# Altium schematic sheet Housekeeping.SchDoc
size B; SheetNumber: 2; SheetTotal: 5
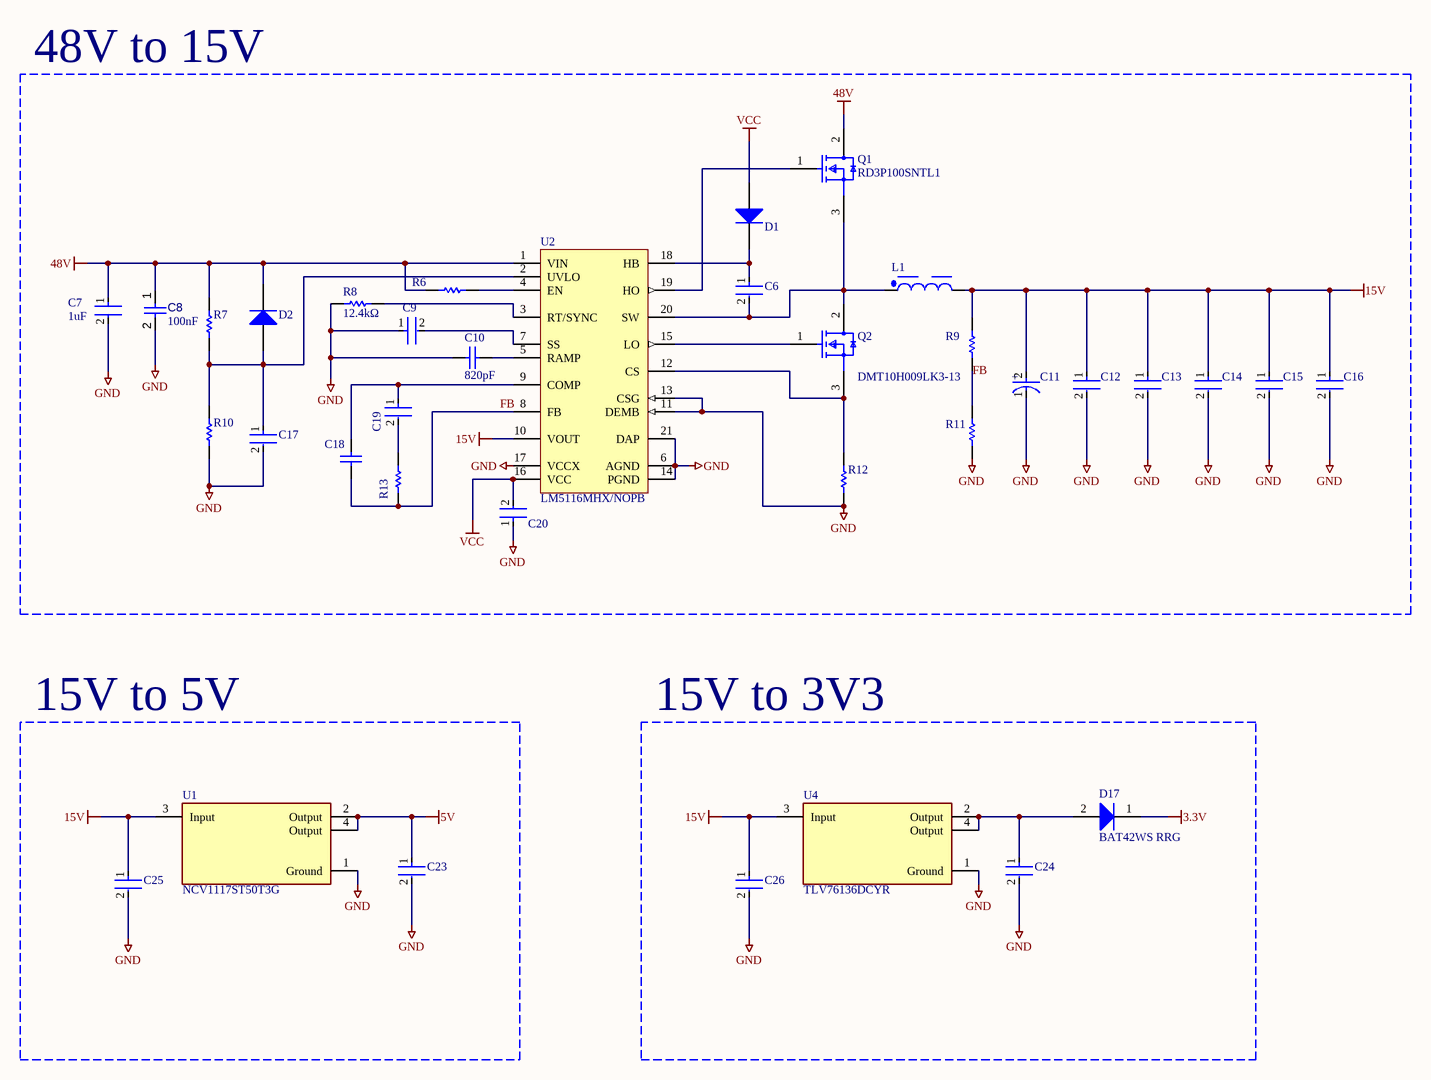
[diagram p0: Housekeeping.SchDoc]

## Parts
C6  UMK107AB7105KA-T  [FP-0603-L_1_6_0_15-W_0_8-IPC_C]  (value not drawn)
C7  Capacitance: 1uF  [FP-C1210C105K1RACTU-MFG]  (hidden comment: C1210C105K1RACTU)
C8  value 100nF  [FP-CL10-IPC_B]  (hidden comment: CL10B104KC8NNNC)
C9  CL10B104KC8NNNC  [FP-CL10-IPC_A]  (value not drawn)
C10  value 820pF  [0603N821J500CT-Footprint-1]  (hidden comment: 0603N821J500CT)
C11  50SVPF10M  [FP-OS-CON-SMT-C6-MFG]  (value not drawn)
C12  CL31A106KBHNNNE  [FP-CL31-IPC_C]  (value not drawn)
C13  CL31A106KBHNNNE  [FP-CL31-IPC_C]  (value not drawn)
C14  CL31A106KBHNNNE  [FP-CL31-IPC_C]  (value not drawn)
C15  CL31A106KBHNNNE  [FP-CL31-IPC_C]  (value not drawn)
C16  CL31A106KBHNNNE  [FP-CL31-IPC_C]  (value not drawn)
C17  UMK107AB7105KA-T  [FP-0603-L_1_6_0_15-W_0_8-IPC_C]  (value not drawn)
C18  CC0603JRNPO9BN101  [CAPC1608X90X40ML10T20]  (value not drawn)
C19  C0603C332J5RACTU  [FP-C0603C-CF-MFG]  (value not drawn)
C20  UMK107AB7105KA-T  [FP-0603-L_1_6_0_15-W_0_8-IPC_C]  (value not drawn)
C23  CC0603KRX5R6BB106  [FP-CC0603-DC-MFG]  (value not drawn)
C24  CC0603KRX5R6BB106  [FP-CC0603-DC-MFG]  (value not drawn)
C25  UMK107AB7105KA-T  [FP-0603-L_1_6_0_15-W_0_8-IPC_C]  (value not drawn)
C26  UMK107AB7105KA-T  [FP-0603-L_1_6_0_15-W_0_8-IPC_C]  (value not drawn)
D1  LL4148  [FAIR-SOD80-2_V]  (value not drawn)
D2  LL4148  [FAIR-SOD80-2_V]  (value not drawn)
D17  BAT42WS RRG  [BAT42WS RRG-Footprint-1]
L1  7447709390  [WE-PD_1210]  (value not drawn)
Q1  RD3P100SNTL1  [DPAK230P990X240-3N]
Q2  DMT10H009LK3-13  [DPAK229P991X239-3N]
R6  RC0603FR-071ML  [RESC1608X55X25LL10T15]  (value not drawn)
R7  ERJ-3EKF6192V  [RESC1608X55X30ML15T15]  (value not drawn)
R8  value 12.4kΩ  [FP-RC0603-0_55-IPC_C]  (hidden comment: RC0603FR-0712K4L)
R9  RC0603FR-0716K2L  [RESC1608X55X25NL10T15]  (value not drawn)
R10  ERJ-3EKF3921V  [RESC1608X55X30LL15T15]  (value not drawn)
R11  ERJ-3EKF1431V  [RESC1608X55X30ML15T15]  (value not drawn)
R12  ERJ8CWFR024V  [RESC3216X70X50NL05T20]  (value not drawn)
R13  ERJ3EKF1802V  [RESC1608X55X30LL15T15]  (value not drawn)
U1  NCV1117ST50T3G  [NCV1117ST50T3G-Footprint-1]
U2  LM5116MHX/NOPB  [PWP0020A_M]
U4  TLV76136DCYR  [TLV76136DCYR-Footprint-1]

## Blocks framed on the sheet
48V to 15V: C6-C20 D1 D2 L1 Q1 Q2 R6-R13 U2
15V to 5V: C23 C25 U1
15V to 3V3: C24 C26 D17 U4

## Nets
3.3V: D17.1(K)
5V: C23.1 U1.2(Output) U1.4(Output)
15V: C11.2(A) C12.1 C13.1 C14.1 C15.1 C16.1 C25.1 C26.1 L1.2 R9.2 U1.3(Input) U2.10(VOUT) U4.3(Input)
48V: C7.1 C8.1 D2.2(K) Q1.2 R6.1 R7.2 U2.1(VIN)
GND: C7.2 C8.2 C9.1 C10.1 C11.1(C) C12.2 C13.2 C14.2 C15.2 C16.2 C17.2 C20.1 C23.2 C24.2 C25.2 C26.2 R8.1 R10.1 R11.1 R12.1 U1.1(Ground) U2.6(AGND) U2.11(DEMB) U2.13(CSG) U2.14(PGND) U2.17(VCCX) U2.21(DAP) U4.1(Ground)
VCC: C20.2 D1.1(A) U2.16(VCC)
FB: C18.1 R9.1 R11.2 R13.1 U2.8(FB)
NetC6_1: C6.1 D1.2(K) U2.18(HB)
NetC6_2: C6.2 L1.1 Q1.3 Q2.2(D) U2.20(SW)
NetC9_2: C9.2 U2.7(SS)
NetC10_2: C10.2 U2.5(RAMP)
NetC17_1: C17.1 D2.1(A) R7.1 R10.2 U2.2(UVLO)
NetC18_2: C18.2 C19.1 U2.9(COMP)
NetC19_2: C19.2 R13.2
NetC24_1: C24.1 D17.2(A) U4.2(Output) U4.4(Output)
NetQ1_1: Q1.1(Gate) U2.19(HO)
NetQ2_1: Q2.1(G) U2.15(LO)
NetQ2_3: Q2.3(S) R12.2 U2.12(CS)
NetR6_2: R6.2 U2.4(EN)
NetR8_2: R8.2 U2.3(RT/SYNC)

## Notes on the sheet
- (in symbol CMP-05428-000804-1) +

## Library data of the parts
C6 C17 C20 C25 C26 = CMP-2000-07531-4: Ceramic Capacitor General Use 1uF ±10% 50V X7R 0603; Series: M; Width: 0.031inch; Mount: Surface Mount; Radiation Hardening: No; Voltage Rating (DC): 50V; Packaging: Tape and Reel; Termination: SMD/SMT; Depth: 0.8mm; Case Code (Metric): 1608; Case Code (Imperial): 0603; Height: 0.8mm; Voltage Rating: 50V; Package Quantity: 1; Halogen Free: Halogen Free; Dielectric: X7R; Min Operating Temperature: -55°C; Length: 1.6mm; Construction: Flat; Tolerance: 10%; Thickness: 0.037inch; Max Operating Temperature: 125°C; Case/Package: 0603; Capacitance: 1uF; RoHS Compliant: Yes
C7 = CMP-03020-034669-1: CAP CER 1UF 100V X7R 1210; Dielectric Material: Ceramic; Tolerance: 10%; Height: 1.7mm; Voltage Rating: 100V; Termination: SMD/SMT; Depth: 2.5mm; Construction: Flat; REACH SVHC: No SVHC; Length: 3.2mm; Case Code (Imperial): 1210; Radiation Hardening: No; Case/Package: 1210; Case Code (Metric): 3225; Mount: Surface Mount; Package Quantity: 1; Voltage Rating (DC): 100V; Min Operating Temperature: -55°C; Voltage: 100V; Thickness: 0.075inch; Width: 0.098inch; Max Operating Temperature: 125°C; Packaging: Tape and Reel; Series: C; RoHS Compliant: Yes; Number of Pins: 2; Dielectric: X7R
C8 = CMP-001-00090-1: Ceramic Capacitor, Multilayer, Ceramic, 100V, 10% +Tol, 10% -Tol, X7R, 15% TC, 0.1uF, Surface Mount, 0603; Case/Package: 0603; Min Operating Temperature: -55°C; Mounting Technology: Surface Mount; Capacitor Type: Ceramic; Max Operating Temperature: 125°C; Pins: 2; RoHS Compliant: Yes
C9 = CMP-13271-004036-1: Cap Ceramic 100nF 100V X7R ±10% Pad SMD 0603 +125°C T/R; Mount: Surface Mount; Packaging: Cut Tape; Width: 0.031inch; Thickness: 0.035inch; Length: 0.063inch; Tolerance: 10%; Min Operating Temperature: -55°C; Case/Package: 0603; Voltage Rating: 100V; Max Operating Temperature: 125°C; Case Code (Metric): 1608; Capacitance: 100nF; Case Code (Imperial): 0603
C10 = CMP-001-00084-2: 0603 Cap Ceramic 820pF 50V C0G 5% - Multilayer Ceramic Capacitors; Tolerance: 5%; Mounting Technology: Surface Mount; Max Operating Temperature: 125°C; Length: 1.6mm; Height: 800µm; Case/Package: 0603; Case Code (Imperial): 0603; Case Code (Metric): 1608; Number of Terminals: 2; Voltage Rating: 50V; Voltage Rating (DC): 50V; Dielectric: C0G; Radiation Hardening: No; Min Operating Temperature: -55°C; Dielectric Material: Ceramic; REACH SVHC: Yes; Lifecycle Status: Production; China RoHS: Compliant; Width: 800µm; RoHS: Compliant; Lead Free: Lead Free; Depth: 800µm
C11 = CMP-05428-000804-1: Conductive Polymer Aluminum Solid Capacitors (OS-CON) 10uF ±20% 50V; ESR (Equivalent Series Resistance): 40mR; Ripple Current: 2.5A; Leakage Current: 100uA; Life (Hours): 5000Hour; Dissipation Factor: 12%; Voltage Rating (DC): 50V; Termination: SMD/SMT; Voltage Rating: 50V; Voltage: 50V; Min Operating Temperature: -55°C; Max Operating Temperature: 105°C; Height - Seated (Max): 0.236inch; Case/Package: Radial; Mount: Surface Mount; Height: 5.9mm; RoHS Compliant: Yes; Diameter: 6.3mm; Construction: Cylindrical; Ripple Current (AC): 2.5A; Series: OS-CON, SVPF; Length: 5.9mm; Package Quantity: 1000; REACH SVHC: No SVHC; Number of Pins: 6; Capacitance: 10uF; Packaging: Tape and Reel; Lead Free: Lead Free; Tolerance: 20%
C12-C16 = CMP-13271-000016-1: CAP CER 10UF 50V X5R 1206; Manufacturer: Samsung; Tolerance: 10%; Material: Ceramic; Temperature Coefficient: 15%; RoHS: TRUE; Ipc Land Pattern Name: CAPC320160X160; Temperature Range Low: -55°C; Value: 10uF; Device Class L3: Ceramic Capacitors; Category: Cap; Temperature Characteristic: X5R; Lead Free: Yes; Device Class L2: Capacitors; Octopart: https://octopart.com/cl31a106kbhnnne-samsung-19832778; ComponentLink2Description: Datasheet; Digikey Description: CAP CER 10UF 50V X5R 1206; Voltage: 50V; ComponentLink2URL: http://www.samsungsem.com/kr/support/product-search/mlcc/__icsFiles/afieldfile/2018/06/21/CL31A106KBHNNNE.pdf; Capacitance: 10uF; Manufacturer Part Number: CL31A106KBHNNNE; Temperature Range High: +85°C; Device Class L1: Passive Components; Height: 1.8mm; Automotive: No; Voltage Rating: 50V; Package: CL31; Temperature: -55°C to +85°C
C18 = CMP-2100-03594-1: Chip Capacitor, 100 pF, +/- 5%, 50 V, -55 to 125 degC, 0603 (1608 Metric), RoHS, Tape and Reel; Manufacturer: Yageo; Capacitance: 100pF; Voltage Rating (DC): 50V; Dielectric: C0G; Temperature Coefficient: 30ppm/degC; Insulation Resistance: 100GR; Datasheet Version: Rev. 14, 07/2016; Manufacturer URL: http://www.yageo.com/; Packaging: TapeandReel; Mount: SurfaceMount; RoHSCompliant: True; Package Reference: 0603; Tolerance: 5%; Max Operating Temperature: 125degC; Case Code (Imperial): 0603; Number of Pins: 2; Width: 0.8mm; Case Code (Metric): 1608; Voltage: 50V; REACH SVHC: Unknown; Package Description: 2-Pin Surface Mount Device, Body 1.6 x 0.8 mm; Composition: Ceramic; Lead Free: LeadFree; Min Operating Temperature: -55degC; Radiation Hardening: No; Depth: 0.8mm; Thickness: 0.035inch; Datasheet URL: http://www.yageo.com/documents/recent/UPY-GP_NP0_16V-to-50V_14.pdf; Termination: SMD/SMT; Package Quantity: 1; Length: 1.6mm; Voltage Rating: 50V; Height: 0.8mm; Case/Package: 0603
C19 = CMP-2006-03174-2: CAP CER 3300PF 50V 5% X7R 0603; Manufacturer: KEMET; Automotive Grade: Grade 1; Material: Ceramic; Value: 3,300 pF; Temperature Coefficient: 30ppm/°C; Tolerance: 0.05; Temperature Range Low: -55°C; Device Class L3: Ceramic Capacitors; Temperature Characteristic: X7R; Temperature: -55°C to +125°C; Device Class L1: Passive Components; ComponentLink2URL: https://api.kemet.com/component-edge/download/datasheet/C0603C100J5GACAUTO.pdf; Automotive: Yes; Capacitance: 3,300 pF; RoHS: TRUE; Mouser Description: Multilayer Ceramic Capacitors MLCC - SMD/SMT 50volts 3300pF X7R 5%; Height: 0.87mm; Manufacturer Part Number: C0603C332J5RACTU; Temperature Range High: +125°C; ComponentLink2Description: Datasheet; Voltage Rating: 50 V; Octopart: https://octopart.com/c0603c332j5ractu-kemet-9139905; Package: C0603C-CF; Lead Free: Yes; Device Class L2: Capacitors; Digikey Description: CAP CER 3300PF 50V 5% X7R 0603; Category: Cap
C23 C24 = CMP-03422-001507-1: CAP CER 10UF 10V X5R 0603; Tolerance: 10%; Case/Package: 0603; Length: 0.063inch; Capacitance: 10uF; Dielectric: X5R; Mount: Surface Mount; Case Code (Metric): 1608; Depth: 0.8mm; Voltage Rating (DC): 10V; Voltage Rating: 10V; Lead Free: Lead Free; Resistor Type: Ceramic; Packaging: Tape and Reel; Max Operating Temperature: 85°C; Termination: SMD/SMT; Min Operating Temperature: -55°C; Weight: 7.1E-05oz; Thickness: 0.035inch; Case Code (Imperial): 0603; Package Quantity: 4000; Halogen Free: Halogen Free; RoHS Compliant: Yes; Width: 0.031inch
D1 D2 = CMP-2000-05115-2: Small Signal Diode, 100 V, 0.2 A, -55 to 175 degC, 2-Pin SOD80, RoHS, Tape and Reel; Manufacturer: Fairchild; Reverse Voltage-Max [Vrrm]: 100V; Average Forward Current-Max: 200mA; Forward Voltage: 1V; Reverse Recovery Time-Max: 1ns; Power Dissipation: 500mW; Datasheet URL: https://www.fairchildsemi.com/datasheets/LL/LL4148.pdf; Manufacturer URL: https://www.fairchildsemi.com/; Datasheet Version: Rev. 1.8, 01/2016
D17 = CMP-004-00032-1: Schottky Diode, 30V, 0.2A, Sod-323F Rohs Compliant: Yes; Manufacturer Lifecycle Status: ACTIVE; Lifecycle Status: Production
L1 = CMP-0227-00184-3: High Current Inductor, Fixed, 1210, 39 Uh, 4.1 A, .056 Ohm, We-pd Series; Inductance: 39µH; RMS Current (Irms): 4.1A; Saturation Current: 5A; Tolerance: 20%; Core Material: Ferrite; Series Resistance: 56mΩ; Self Resonant Frequency: 6MHz; DC Resistance (DCR): 44mΩ; Test Frequency: 1kHz; Shielding: Shielded; Max Operating Temperature: 125°C; RoHS: Compliant; Case/Package: Nonstandard; Height - Seated (Max): 10.0076mm; Number of Pins: 2; REACH SVHC: Unknown; Height: 10mm; Mount: Surface Mount; Ambient Temperature Range Low: -40°C; Case Code (Metric): 3225; Lead Pitch: 7mm; Current Rating: 4.1A; Min Operating Temperature: -40°C; Width: 12mm; Composition: Wirewound; Max DC Current: 4.1A; Case Code (Imperial): 1210; Inductance Tolerance: 20%; Lead Free: Lead Free; Termination: SMD/SMT; Depth: 12mm; Ambient Temperature Range High: 85°C; Length: 12mm
Q1 = CMP-013-00035-2: Transistor MOSFET N-CH 100V 10A 3-Pin TO-252 Emboss T/R; Number of Elements: 1; Drain to Source Resistance: 147mΩ; Min Breakdown Voltage: 100V; Continuous Drain Current (ID): 10A; RoHS: Compliant; REACH SVHC: No; Lifecycle Status: Production; Number of Terminals: 2; Mounting Technology: Surface Mount
Q2 = CMP-013-00037-2: DMT10H009LK3 series N-Channel Mosfet 100V 90A TO252 (DPAK); Number of Elements: 1; Drain to Source Resistance: 9mΩ; Max Power Dissipation: 3W; China RoHS: Non-Compliant; Lifecycle Status: Production; Military Standard: MIL-STD-202; Min Operating Temperature: -55°C; REACH SVHC: No; Continuous Drain Current (ID): 90A; Number of Terminals: 2; Min Breakdown Voltage: 100V; RoHS: Compliant; Max Operating Temperature: 150°C
R6 = CMP-1659-00056-1: Chip Resistor, 1 MOhm, +/- 1%, 100 mW, -55 to 155 degC, 0603 (1608 Metric), RoHS, Tape and Reel; Voltage Rating (DC): 25 V; Tolerance: 20%; Case\Package: Radial; Capacitance: 1 mF; Min Operating Temperature: -40 degC; PackageDescription: 2-Pin Surface Mount Device, Body 1.6 x 0.8 mm; ComponentLink1Description: Manufacturer URL; Radiation Hardening: No; DatasheetVersion: Rev. 4, 02/2016; REACH SVHC: No SVHC; Length: 20 mm; Max Operating Temperature: 85 degC; Diameter: 10 mm; Packaging: Bulk; Package Quantity: 200; PackageReference: 0603; Mount: Through Hole; ComponentLink1URL: http://www.yageo.com/; ComponentLink2URL: http://www.yageo.com/documents/recent/PYu-RC_Group_51_RoHS_L_04.pdf; ComponentLink2Description: Datasheet; Width: 0 inch; Lead Pitch: 5 mm; RoHSCompliant: true; Voltage Rating: 25 V; Height: 20 mm
R7 = CMP-2000-00591-1: Manufacturer: Panasonic; Part Number: ERJ-3EKF6192V
R8 = CMP-009-00181-1: 100mW Thick Film Resistors 75V ±100ppm/℃ ±1% 12.4kΩ 0603 Chip Resistor - Surface Mount ROHS; Temperature Coefficient: 100ppm/°C; Voltage Rating (DC): 50V; Number of Terminals: 2; REACH SVHC: Yes; Depth: 800µm; Min Operating Temperature: -55°C; Max Operating Temperature: 155°C; Termination: SMD/SMT; Mounting Technology: Surface Mount; Width: 800µm; Features: Moisture Resistant; Composition: Thick Film; Working Voltage: 75V; Number of Terminations: 2; Voltage Rating: 75V; Height: 450µm; Case/Package: 0603; Lead Free: Lead Free; China RoHS: Non-Compliant; Tolerance: 1%; Case Code (Imperial): 0603; RoHS: Compliant; Power Dissipation: 100mW; Military Standard: Not; Power Rating: 100mW; Lifecycle Status: Production; Packaging: Tape & Reel; Max Power Dissipation: 100mW; Schedule B: 8533210045, 8533210045; Length: 1.6002mm
R9 = CMP-1012-00645-2: Manufacturer: Yageo; Part Number: RC0603FR-0716K2L
R10 = CMP-2000-00479-1: Manufacturer: Panasonic; Part Number: ERJ-3EKF3921V
R11 = CMP-2000-00250-1: Manufacturer: Panasonic; Part Number: ERJ-3EKF1431V
R12 = CMP-2003-00795-1: Manufacturer: Panasonic; Part Number: ERJ8CWFR024V
R13 = CMP-1012-00650-3: Fixed Resistor, Metal Glaze/thick Film, 0.1W, 18000ohm, 75V, 1% +/-Tol, 100ppm/Cel, Surface Mount, 0603; Manufacturer: Panasonic; Part Number: ERJ3EKF1802V
U1 = CMP-019-00053-2: IC REG LDO 5V 1A SOT223 / LDO Regulator Pos 5V 1A Automotive 4-Pin(3+Tab) SOT-223 T/R
U2 = CMP-0069-01482-3: Wide Range Synchronous Buck Controller, 20-pin TSSOP-EP, Pb-Free; Manufacturer: Texas Instruments; PackageTopMarking: NSUZXYTT*LM5116*MH; PowerWise: Y; CompType: Switcher; ComponentLink1URL: http://www.ti.com/general/docs/lit/getliterature.tsp?genericPartNumber=LM5116&fileType=pdf; PackageReference: PWP0020A; RoHS: Y; PinCount: 20; Code_JEDEC: MO-153-ACT; PackageDescription: Molded TSSOP, Jedec, 6.5 x 4.4 x 0.9mm Body, 20 Lead, 0.65mm Pitch, Exposed Pad; ComponentLink1Description: Datasheet URL
U4 = CMP-019-00054-3: 1A 16V high-PSRR linear voltage regulator 4-SOT-223 -40 to 125; Manufacturer Lifecycle Status: ACTIVE; Length: 6.5mm; RoHS: Compliant; Thickness: 1.6mm; Width: 3.5mm; Case/Package: SOT-223; Lifecycle Status: Production; Pins: 4; Height: 1.8mm